# EAGLE schematic experiment-sig60-schematic (EAGLE 7.7.0)
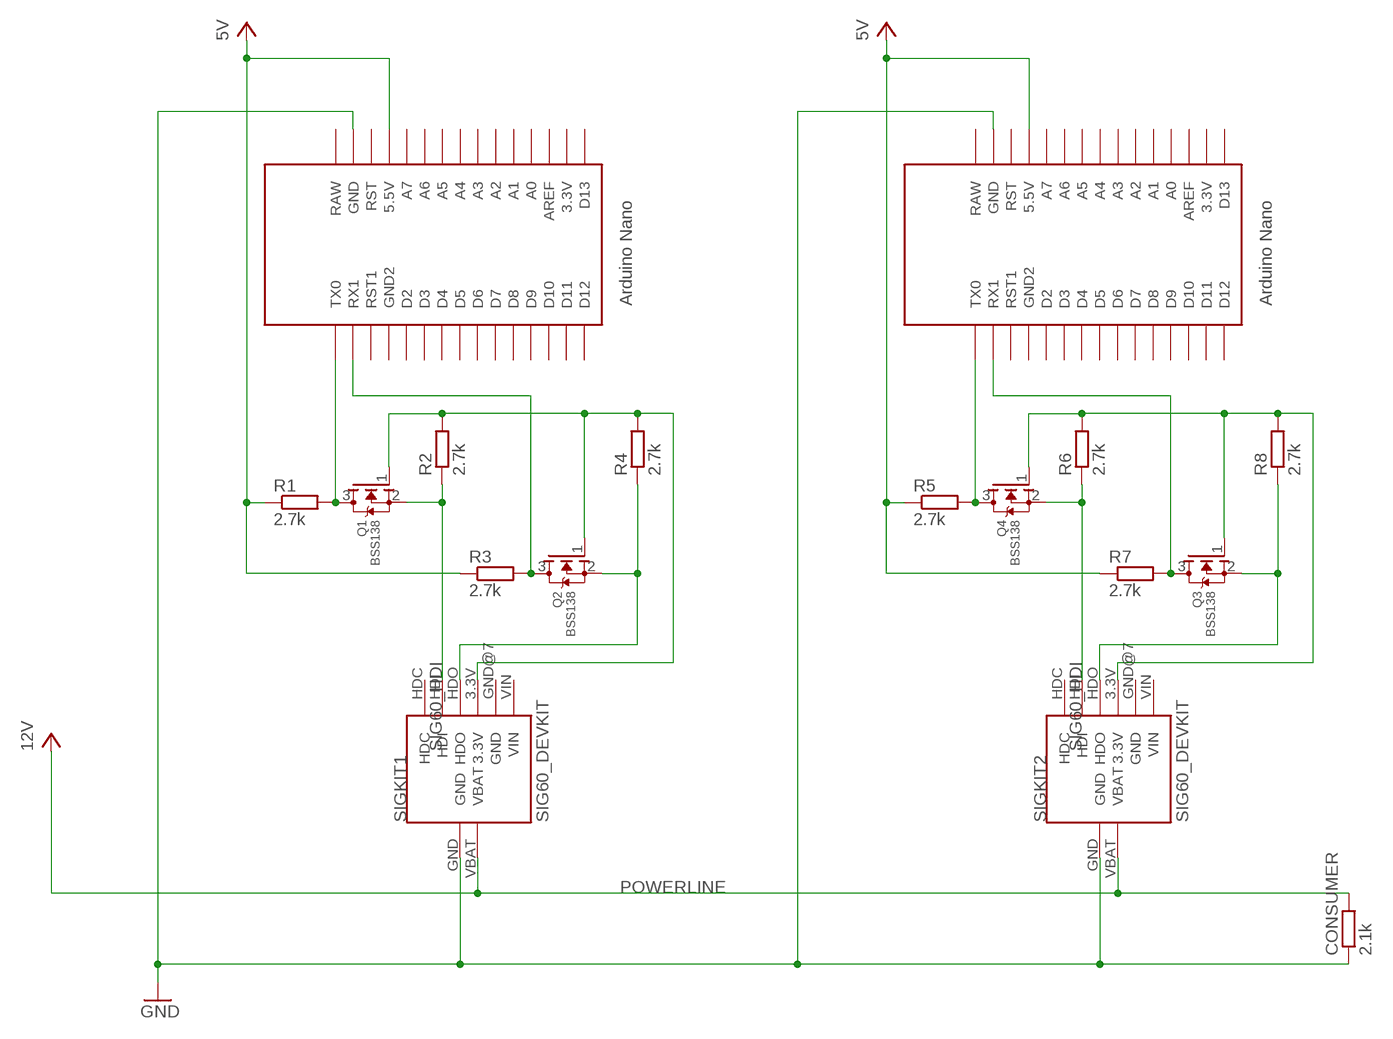
[diagram p0: schematic, sheet 1]

## Parts
CONSUMER  2.1k  R0207/10  [0207/10]
Q1  BSS138  MOSFET-NREFLOW  [SOT23]
Q2  BSS138  MOSFET-NREFLOW  [SOT23]
Q3  BSS138  MOSFET-NREFLOW  [SOT23]
Q4  BSS138  MOSFET-NREFLOW  [SOT23]
R1  2.7k  R0207/10  [0207/10]
R2  2.7k  R0207/10  [0207/10]
R3  2.7k  R0207/10  [0207/10]
R4  2.7k  R0207/10  [0207/10]
R5  2.7k  R0207/10  [0207/10]
R6  2.7k  R0207/10  [0207/10]
R7  2.7k  R0207/10  [0207/10]
R8  2.7k  R0207/10  [0207/10]
SIGKIT1  SIG60_DEVKIT  [SIG_DEVKIT]
SIGKIT2  SIG60_DEVKIT  [SIG_DEVKIT]
U$1  NANO  [NANO]
U$2  NANO  [NANO]

## Nets
GND: CONSUMER.1 SIGKIT1.GND SIGKIT2.GND U$1.GND U$2.GND
N$1: Q1.3(D) R1.2 U$1.TX0
N$2: Q1.1(G) Q2.1(G) R2.2 R4.2 SIGKIT1.3.3V
N$3: Q2.3(D) R3.2 U$1.RX1
N$4: Q4.3(D) R5.2 U$2.TX0
N$5: Q3.3(D) R7.2 U$2.RX1
N$6: Q3.1(G) Q4.1(G) R6.2 R8.2 SIGKIT2.3.3V
POWERLINE: CONSUMER.2 SIGKIT1.VBAT SIGKIT2.VBAT ; supply symbol labelled 12V
SIG60_HDI: Q1.2(S) Q4.2(S) R2.1 R6.1 SIGKIT1.HDI SIGKIT2.HDI
SIG60_HDO: Q2.2(S) R4.1 SIGKIT1.HDO
SIG60_HDO1: Q3.2(S) R8.1 SIGKIT2.HDO
VCC: R1.1 R3.1 R5.1 R7.1 U$1.5V(5.5V) U$2.5V(5.5V) ; supply symbol labelled 5V
Unconnected: SIGKIT1.GND@7(GND) SIGKIT1.HDC SIGKIT1.VIN SIGKIT2.GND@7(GND) SIGKIT2.HDC SIGKIT2.VIN U$1.3.3V U$1.A0 U$1.A1 U$1.A2 U$1.A3 U$1.A4 U$1.A5 U$1.A6 U$1.A7 U$1.AREF U$1.D2 U$1.D3 U$1.D4 U$1.D5 U$1.D6 U$1.D7 U$1.D8 U$1.D9 U$1.D10 U$1.D11 U$1.D12 U$1.D13 U$1.GND1(GND2) U$1.ICSP1 U$1.ICSP2 U$1.ICSP3 U$1.ICSP4 U$1.ICSP5 U$1.ICSP6 U$1.RAW U$1.RST U$1.RST1 U$2.3.3V U$2.A0 U$2.A1 U$2.A2 U$2.A3 U$2.A4 U$2.A5 U$2.A6 U$2.A7 U$2.AREF U$2.D2 U$2.D3 U$2.D4 U$2.D5 U$2.D6 U$2.D7 U$2.D8 U$2.D9 U$2.D10 U$2.D11 U$2.D12 U$2.D13 U$2.GND1(GND2) U$2.ICSP1 U$2.ICSP2 U$2.ICSP3 U$2.ICSP4 U$2.ICSP5 U$2.ICSP6 U$2.RAW U$2.RST U$2.RST1

## Library data of the parts
CONSUMER R1-R8 = eagle-ltspice:R: RESISTOR, European symbol; SPICEMODEL: NONE; SPICEPREFIX: R
Q1-Q4 = adafruit:MOSFET-N: N-Channel Mosfet 2N7002E - 60V 260mA SOT23 [Digikey: 2N7002ET1GOSTR-ND] - REEL BSH103 - 30V 850mA SOT23 [Digikey: 568-5013-1-ND]
SIGKIT1 SIGKIT2 = SIG60_schematic:SIG60_DEVKIT
U$1 U$2 = Arduino-clone:NANO: Arduino Nano

## Module LINEDRIVER
Ports: 

### Library data of the parts